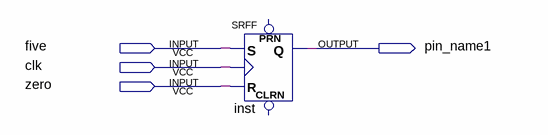
[diagram p0: schematic sheet]
// Quartus schematic test.bdf as structural Verilog: 1 symbols, 4 pins
module test (
  input  five,
  input  clk,
  input  zero,
  output pin_name1
);

  SRFF inst (.S(five), .R(zero), .CLK(clk), .Q(pin_name1));  // open: PRN, CLRN
endmodule
